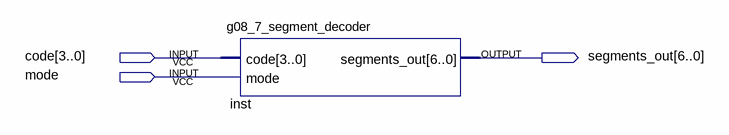
[diagram p0: schematic sheet]
// Quartus schematic g08_7_segs.bdf as structural Verilog: 1 symbols, 3 pins
module g08_7_segs (
  input  [3:0] code,
  input  mode,
  output [6:0] segments_out
);

  g08_7_segment_decoder inst (.code(code), .mode(mode), .segments_out(segments_out));
endmodule
